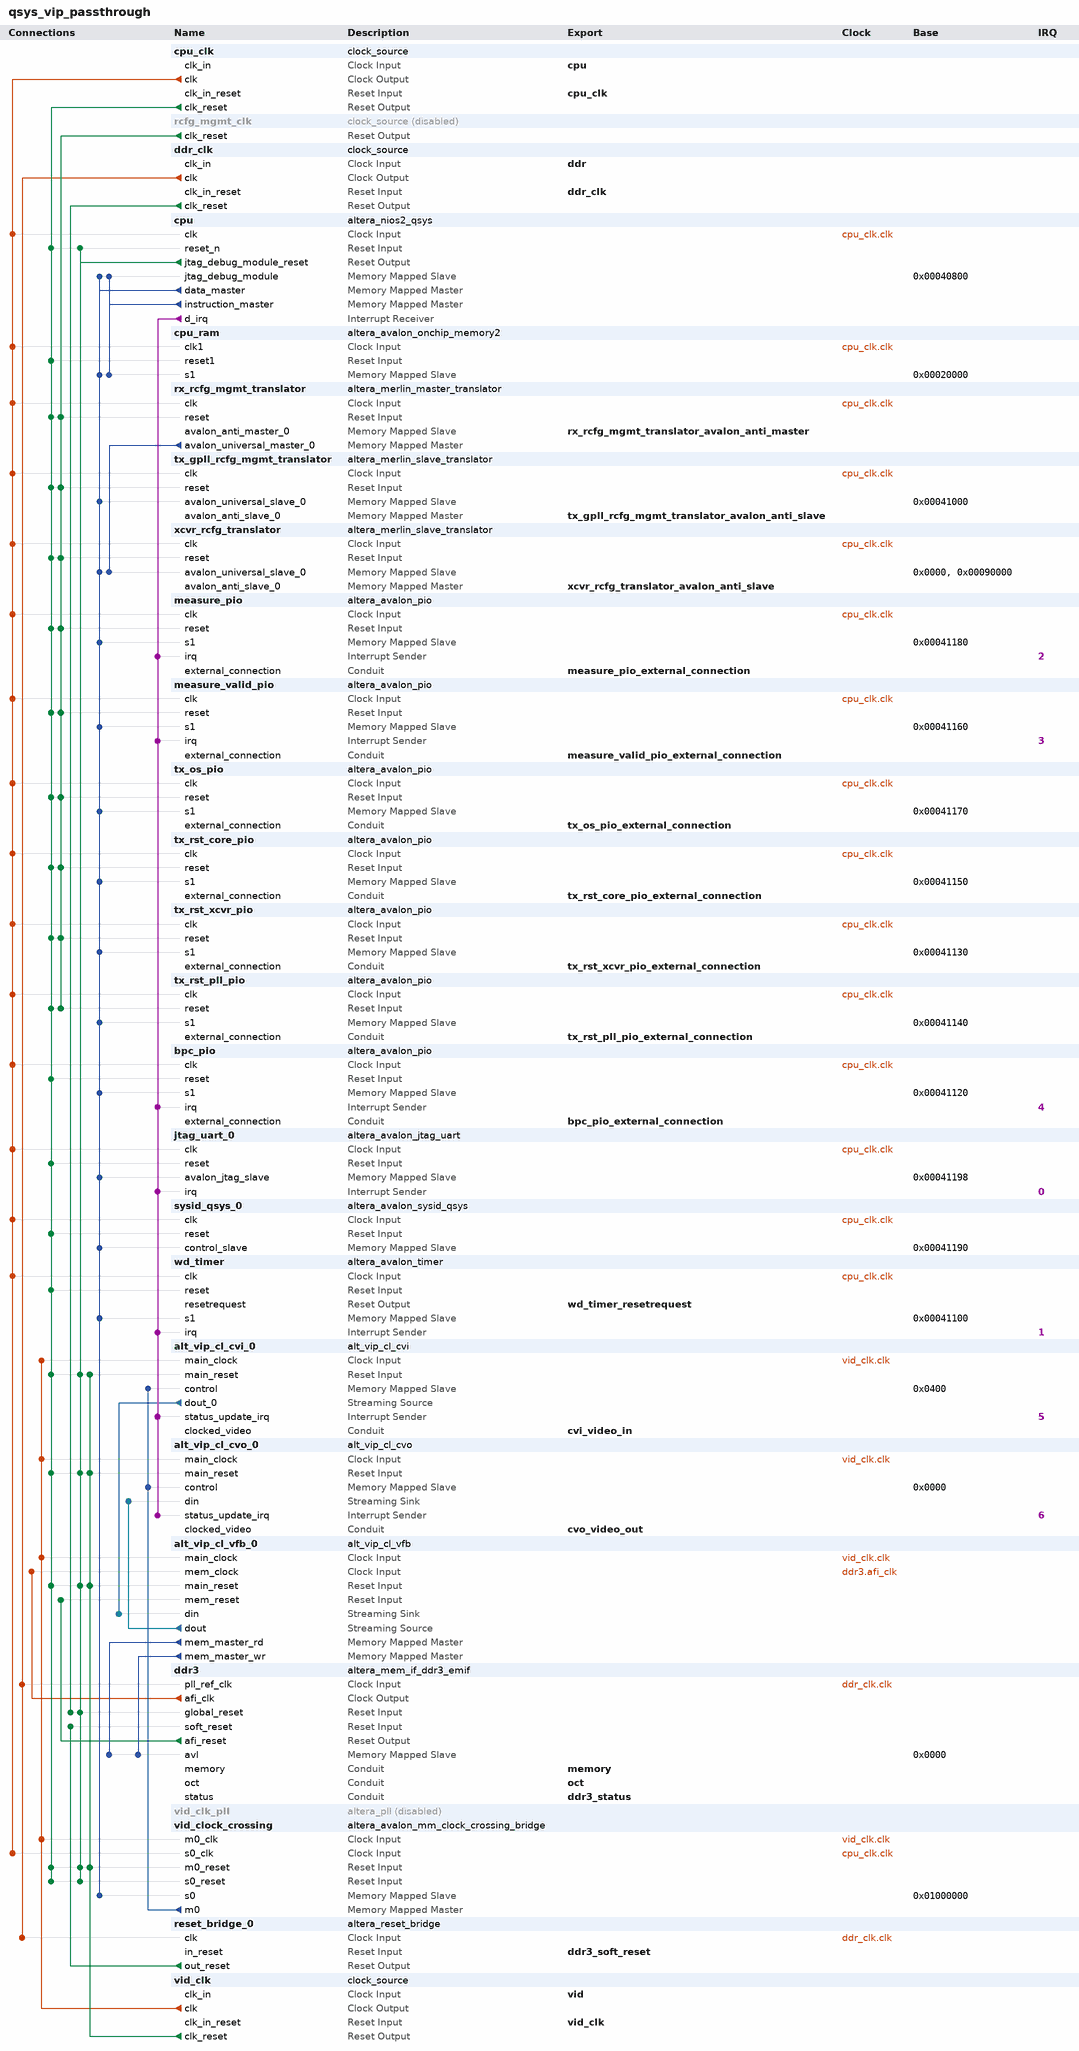
[diagram p0: system contents]
# Platform Designer (Qsys) system qsys_vip_passthrough, Arria V 5AGXFB3H4F35C4
# Parameters at their usual value, and those the tool derives, are not listed.
package require -exact qsys 17.0
create_system qsys_vip_passthrough
set_project_property DEVICE_FAMILY {Arria V}
set_project_property DEVICE 5AGXFB3H4F35C4

add_instance cpu_clk clock_source 17.0
set_instance_parameter_value cpu_clk clockFrequency 75000000

add_instance rcfg_mgmt_clk clock_source 17.0
set_instance_property rcfg_mgmt_clk ENABLED false
set_instance_parameter_value rcfg_mgmt_clk clockFrequency 75000000

add_instance ddr_clk clock_source 17.0
set_instance_parameter_value ddr_clk clockFrequency 100000000

add_instance cpu altera_nios2_qsys 17.0
set_instance_parameter_value cpu breakSlave cpu.jtag_debug_module
set_instance_parameter_value cpu exceptionSlave cpu_ram.s1
set_instance_parameter_value cpu icache_size 4096
set_instance_parameter_value cpu impl Tiny
set_instance_parameter_value cpu mmu_TLBMissExcSlave None
set_instance_parameter_value cpu muldiv_multiplierType DSPBlock
set_instance_parameter_value cpu resetSlave cpu_ram.s1
set_instance_parameter_value cpu resetrequest_enabled true

add_instance cpu_ram altera_avalon_onchip_memory2 17.0
set_instance_parameter_value cpu_ram dataWidth 32
set_instance_parameter_value cpu_ram dualPort false
set_instance_parameter_value cpu_ram initMemContent true
set_instance_parameter_value cpu_ram initializationFileName onchip_mem.hex
set_instance_parameter_value cpu_ram memorySize 80000

add_instance rx_rcfg_mgmt_translator altera_merlin_master_translator 17.0
set_instance_parameter_value rx_rcfg_mgmt_translator AV_ADDRESSGROUP 0
set_instance_parameter_value rx_rcfg_mgmt_translator AV_ADDRESS_SYMBOLS 1
set_instance_parameter_value rx_rcfg_mgmt_translator AV_ADDRESS_W 9
set_instance_parameter_value rx_rcfg_mgmt_translator AV_ALWAYSBURSTMAXBURST 0
set_instance_parameter_value rx_rcfg_mgmt_translator AV_BITS_PER_SYMBOL 8
set_instance_parameter_value rx_rcfg_mgmt_translator AV_BURSTBOUNDARIES 0
set_instance_parameter_value rx_rcfg_mgmt_translator AV_BURSTCOUNT_SYMBOLS 0
set_instance_parameter_value rx_rcfg_mgmt_translator AV_BURSTCOUNT_W 1
set_instance_parameter_value rx_rcfg_mgmt_translator AV_BYTEENABLE_W 4
set_instance_parameter_value rx_rcfg_mgmt_translator AV_CONSTANT_BURST_BEHAVIOR 0
set_instance_parameter_value rx_rcfg_mgmt_translator AV_DATA_HOLD 0
set_instance_parameter_value rx_rcfg_mgmt_translator AV_DATA_W 32
set_instance_parameter_value rx_rcfg_mgmt_translator AV_INTERLEAVEBURSTS 0
set_instance_parameter_value rx_rcfg_mgmt_translator AV_ISBIGENDIAN 0
set_instance_parameter_value rx_rcfg_mgmt_translator AV_LINEWRAPBURSTS 0
set_instance_parameter_value rx_rcfg_mgmt_translator AV_MAX_PENDING_READ_TRANSACTIONS 64
set_instance_parameter_value rx_rcfg_mgmt_translator AV_READLATENCY 0
set_instance_parameter_value rx_rcfg_mgmt_translator AV_READ_WAIT 0
set_instance_parameter_value rx_rcfg_mgmt_translator AV_REGISTERINCOMINGSIGNALS 0
set_instance_parameter_value rx_rcfg_mgmt_translator AV_REGISTEROUTGOINGSIGNALS 0
set_instance_parameter_value rx_rcfg_mgmt_translator AV_SETUP_WAIT 0
set_instance_parameter_value rx_rcfg_mgmt_translator AV_SYMBOLS_PER_WORD 4
set_instance_parameter_value rx_rcfg_mgmt_translator AV_WRITE_WAIT 0
set_instance_parameter_value rx_rcfg_mgmt_translator SYNC_RESET 0
set_instance_parameter_value rx_rcfg_mgmt_translator UAV_ADDRESSGROUP 0
set_instance_parameter_value rx_rcfg_mgmt_translator UAV_ADDRESS_W 9
set_instance_parameter_value rx_rcfg_mgmt_translator UAV_BURSTCOUNT_W 3
set_instance_parameter_value rx_rcfg_mgmt_translator UAV_CONSTANT_BURST_BEHAVIOR 0
set_instance_parameter_value rx_rcfg_mgmt_translator USE_ADDRESS 1
set_instance_parameter_value rx_rcfg_mgmt_translator USE_BEGINBURSTTRANSFER 0
set_instance_parameter_value rx_rcfg_mgmt_translator USE_BEGINTRANSFER 0
set_instance_parameter_value rx_rcfg_mgmt_translator USE_BURSTCOUNT 0
set_instance_parameter_value rx_rcfg_mgmt_translator USE_BYTEENABLE 0
set_instance_parameter_value rx_rcfg_mgmt_translator USE_CHIPSELECT 0
set_instance_parameter_value rx_rcfg_mgmt_translator USE_CLKEN 0
set_instance_parameter_value rx_rcfg_mgmt_translator USE_DEBUGACCESS 0
set_instance_parameter_value rx_rcfg_mgmt_translator USE_LOCK 0
set_instance_parameter_value rx_rcfg_mgmt_translator USE_READ 1
set_instance_parameter_value rx_rcfg_mgmt_translator USE_READDATA 1
set_instance_parameter_value rx_rcfg_mgmt_translator USE_READDATAVALID 0
set_instance_parameter_value rx_rcfg_mgmt_translator USE_READRESPONSE 0
set_instance_parameter_value rx_rcfg_mgmt_translator USE_WAITREQUEST 1
set_instance_parameter_value rx_rcfg_mgmt_translator USE_WRITE 1
set_instance_parameter_value rx_rcfg_mgmt_translator USE_WRITEDATA 1
set_instance_parameter_value rx_rcfg_mgmt_translator USE_WRITERESPONSE 0

add_instance tx_gpll_rcfg_mgmt_translator altera_merlin_slave_translator 17.0
set_instance_parameter_value tx_gpll_rcfg_mgmt_translator AV_ADDRESSGROUP 0
set_instance_parameter_value tx_gpll_rcfg_mgmt_translator AV_ADDRESS_SYMBOLS 0
set_instance_parameter_value tx_gpll_rcfg_mgmt_translator AV_ADDRESS_W 6
set_instance_parameter_value tx_gpll_rcfg_mgmt_translator AV_ALWAYSBURSTMAXBURST 0
set_instance_parameter_value tx_gpll_rcfg_mgmt_translator AV_BITS_PER_SYMBOL 8
set_instance_parameter_value tx_gpll_rcfg_mgmt_translator AV_BURSTBOUNDARIES 0
set_instance_parameter_value tx_gpll_rcfg_mgmt_translator AV_BURSTCOUNT_SYMBOLS 0
set_instance_parameter_value tx_gpll_rcfg_mgmt_translator AV_BURSTCOUNT_W 1
set_instance_parameter_value tx_gpll_rcfg_mgmt_translator AV_BYTEENABLE_W 4
set_instance_parameter_value tx_gpll_rcfg_mgmt_translator AV_CONSTANT_BURST_BEHAVIOR 0
set_instance_parameter_value tx_gpll_rcfg_mgmt_translator AV_DATA_HOLD 0
set_instance_parameter_value tx_gpll_rcfg_mgmt_translator AV_DATA_W 32
set_instance_parameter_value tx_gpll_rcfg_mgmt_translator AV_INTERLEAVEBURSTS 0
set_instance_parameter_value tx_gpll_rcfg_mgmt_translator AV_ISBIGENDIAN 0
set_instance_parameter_value tx_gpll_rcfg_mgmt_translator AV_LINEWRAPBURSTS 0
set_instance_parameter_value tx_gpll_rcfg_mgmt_translator AV_MAX_PENDING_READ_TRANSACTIONS 64
set_instance_parameter_value tx_gpll_rcfg_mgmt_translator AV_MAX_PENDING_WRITE_TRANSACTIONS 0
set_instance_parameter_value tx_gpll_rcfg_mgmt_translator AV_READLATENCY 0
set_instance_parameter_value tx_gpll_rcfg_mgmt_translator AV_READ_WAIT 1
set_instance_parameter_value tx_gpll_rcfg_mgmt_translator AV_REGISTERINCOMINGSIGNALS 0
set_instance_parameter_value tx_gpll_rcfg_mgmt_translator AV_REGISTEROUTGOINGSIGNALS 0
set_instance_parameter_value tx_gpll_rcfg_mgmt_translator AV_REQUIRE_UNALIGNED_ADDRESSES 0
set_instance_parameter_value tx_gpll_rcfg_mgmt_translator AV_SETUP_WAIT 0
set_instance_parameter_value tx_gpll_rcfg_mgmt_translator AV_SYMBOLS_PER_WORD 4
set_instance_parameter_value tx_gpll_rcfg_mgmt_translator AV_TIMING_UNITS 1
set_instance_parameter_value tx_gpll_rcfg_mgmt_translator AV_WRITE_WAIT 0
set_instance_parameter_value tx_gpll_rcfg_mgmt_translator CHIPSELECT_THROUGH_READLATENCY 0
set_instance_parameter_value tx_gpll_rcfg_mgmt_translator CLOCK_RATE 75000000
set_instance_parameter_value tx_gpll_rcfg_mgmt_translator UAV_ADDRESSGROUP 0
set_instance_parameter_value tx_gpll_rcfg_mgmt_translator UAV_ADDRESS_W 9
set_instance_parameter_value tx_gpll_rcfg_mgmt_translator UAV_BURSTCOUNT_W 3
set_instance_parameter_value tx_gpll_rcfg_mgmt_translator UAV_BYTEENABLE_W 4
set_instance_parameter_value tx_gpll_rcfg_mgmt_translator UAV_CONSTANT_BURST_BEHAVIOR 0
set_instance_parameter_value tx_gpll_rcfg_mgmt_translator UAV_DATA_W 32
set_instance_parameter_value tx_gpll_rcfg_mgmt_translator USE_ADDRESS 1
set_instance_parameter_value tx_gpll_rcfg_mgmt_translator USE_AV_CLKEN 0
set_instance_parameter_value tx_gpll_rcfg_mgmt_translator USE_BEGINBURSTTRANSFER 0
set_instance_parameter_value tx_gpll_rcfg_mgmt_translator USE_BEGINTRANSFER 0
set_instance_parameter_value tx_gpll_rcfg_mgmt_translator USE_BURSTCOUNT 0
set_instance_parameter_value tx_gpll_rcfg_mgmt_translator USE_BYTEENABLE 0
set_instance_parameter_value tx_gpll_rcfg_mgmt_translator USE_CHIPSELECT 0
set_instance_parameter_value tx_gpll_rcfg_mgmt_translator USE_DEBUGACCESS 0
set_instance_parameter_value tx_gpll_rcfg_mgmt_translator USE_LOCK 0
set_instance_parameter_value tx_gpll_rcfg_mgmt_translator USE_OUTPUTENABLE 0
set_instance_parameter_value tx_gpll_rcfg_mgmt_translator USE_READ 1
set_instance_parameter_value tx_gpll_rcfg_mgmt_translator USE_READDATA 1
set_instance_parameter_value tx_gpll_rcfg_mgmt_translator USE_READDATAVALID 0
set_instance_parameter_value tx_gpll_rcfg_mgmt_translator USE_READRESPONSE 0
set_instance_parameter_value tx_gpll_rcfg_mgmt_translator USE_UAV_CLKEN 0
set_instance_parameter_value tx_gpll_rcfg_mgmt_translator USE_WAITREQUEST 1
set_instance_parameter_value tx_gpll_rcfg_mgmt_translator USE_WRITE 1
set_instance_parameter_value tx_gpll_rcfg_mgmt_translator USE_WRITEBYTEENABLE 0
set_instance_parameter_value tx_gpll_rcfg_mgmt_translator USE_WRITEDATA 1
set_instance_parameter_value tx_gpll_rcfg_mgmt_translator USE_WRITERESPONSE 0

add_instance xcvr_rcfg_translator altera_merlin_slave_translator 17.0
set_instance_parameter_value xcvr_rcfg_translator AV_ADDRESSGROUP 0
set_instance_parameter_value xcvr_rcfg_translator AV_ADDRESS_SYMBOLS 0
set_instance_parameter_value xcvr_rcfg_translator AV_ADDRESS_W 7
set_instance_parameter_value xcvr_rcfg_translator AV_ALWAYSBURSTMAXBURST 0
set_instance_parameter_value xcvr_rcfg_translator AV_BITS_PER_SYMBOL 8
set_instance_parameter_value xcvr_rcfg_translator AV_BURSTBOUNDARIES 0
set_instance_parameter_value xcvr_rcfg_translator AV_BURSTCOUNT_SYMBOLS 0
set_instance_parameter_value xcvr_rcfg_translator AV_BURSTCOUNT_W 1
set_instance_parameter_value xcvr_rcfg_translator AV_BYTEENABLE_W 4
set_instance_parameter_value xcvr_rcfg_translator AV_CONSTANT_BURST_BEHAVIOR 0
set_instance_parameter_value xcvr_rcfg_translator AV_DATA_HOLD 0
set_instance_parameter_value xcvr_rcfg_translator AV_DATA_W 32
set_instance_parameter_value xcvr_rcfg_translator AV_INTERLEAVEBURSTS 0
set_instance_parameter_value xcvr_rcfg_translator AV_ISBIGENDIAN 0
set_instance_parameter_value xcvr_rcfg_translator AV_LINEWRAPBURSTS 0
set_instance_parameter_value xcvr_rcfg_translator AV_MAX_PENDING_READ_TRANSACTIONS 64
set_instance_parameter_value xcvr_rcfg_translator AV_MAX_PENDING_WRITE_TRANSACTIONS 0
set_instance_parameter_value xcvr_rcfg_translator AV_READLATENCY 0
set_instance_parameter_value xcvr_rcfg_translator AV_READ_WAIT 1
set_instance_parameter_value xcvr_rcfg_translator AV_REGISTERINCOMINGSIGNALS 0
set_instance_parameter_value xcvr_rcfg_translator AV_REGISTEROUTGOINGSIGNALS 0
set_instance_parameter_value xcvr_rcfg_translator AV_REQUIRE_UNALIGNED_ADDRESSES 0
set_instance_parameter_value xcvr_rcfg_translator AV_SETUP_WAIT 0
set_instance_parameter_value xcvr_rcfg_translator AV_SYMBOLS_PER_WORD 4
set_instance_parameter_value xcvr_rcfg_translator AV_TIMING_UNITS 1
set_instance_parameter_value xcvr_rcfg_translator AV_WRITE_WAIT 0
set_instance_parameter_value xcvr_rcfg_translator CHIPSELECT_THROUGH_READLATENCY 0
set_instance_parameter_value xcvr_rcfg_translator CLOCK_RATE 75000000
set_instance_parameter_value xcvr_rcfg_translator UAV_ADDRESSGROUP 0
set_instance_parameter_value xcvr_rcfg_translator UAV_ADDRESS_W 9
set_instance_parameter_value xcvr_rcfg_translator UAV_BURSTCOUNT_W 3
set_instance_parameter_value xcvr_rcfg_translator UAV_BYTEENABLE_W 4
set_instance_parameter_value xcvr_rcfg_translator UAV_CONSTANT_BURST_BEHAVIOR 0
set_instance_parameter_value xcvr_rcfg_translator UAV_DATA_W 32
set_instance_parameter_value xcvr_rcfg_translator USE_ADDRESS 1
set_instance_parameter_value xcvr_rcfg_translator USE_AV_CLKEN 0
set_instance_parameter_value xcvr_rcfg_translator USE_BEGINBURSTTRANSFER 0
set_instance_parameter_value xcvr_rcfg_translator USE_BEGINTRANSFER 0
set_instance_parameter_value xcvr_rcfg_translator USE_BURSTCOUNT 0
set_instance_parameter_value xcvr_rcfg_translator USE_BYTEENABLE 0
set_instance_parameter_value xcvr_rcfg_translator USE_CHIPSELECT 0
set_instance_parameter_value xcvr_rcfg_translator USE_DEBUGACCESS 0
set_instance_parameter_value xcvr_rcfg_translator USE_LOCK 0
set_instance_parameter_value xcvr_rcfg_translator USE_OUTPUTENABLE 0
set_instance_parameter_value xcvr_rcfg_translator USE_READ 1
set_instance_parameter_value xcvr_rcfg_translator USE_READDATA 1
set_instance_parameter_value xcvr_rcfg_translator USE_READDATAVALID 0
set_instance_parameter_value xcvr_rcfg_translator USE_READRESPONSE 0
set_instance_parameter_value xcvr_rcfg_translator USE_UAV_CLKEN 0
set_instance_parameter_value xcvr_rcfg_translator USE_WAITREQUEST 1
set_instance_parameter_value xcvr_rcfg_translator USE_WRITE 1
set_instance_parameter_value xcvr_rcfg_translator USE_WRITEBYTEENABLE 0
set_instance_parameter_value xcvr_rcfg_translator USE_WRITEDATA 1
set_instance_parameter_value xcvr_rcfg_translator USE_WRITERESPONSE 0

add_instance measure_pio altera_avalon_pio 17.0
set_instance_parameter_value measure_pio bitClearingEdgeCapReg true
set_instance_parameter_value measure_pio captureEdge true
set_instance_parameter_value measure_pio direction Input
set_instance_parameter_value measure_pio edgeType ANY
set_instance_parameter_value measure_pio generateIRQ true
set_instance_parameter_value measure_pio irqType EDGE
set_instance_parameter_value measure_pio simDoTestBenchWiring true
set_instance_parameter_value measure_pio width 24

add_instance measure_valid_pio altera_avalon_pio 17.0
set_instance_parameter_value measure_valid_pio bitClearingEdgeCapReg true
set_instance_parameter_value measure_valid_pio captureEdge true
set_instance_parameter_value measure_valid_pio direction Input
set_instance_parameter_value measure_valid_pio edgeType ANY
set_instance_parameter_value measure_valid_pio generateIRQ true
set_instance_parameter_value measure_valid_pio irqType EDGE
set_instance_parameter_value measure_valid_pio simDoTestBenchWiring true
set_instance_parameter_value measure_valid_pio width 1

add_instance tx_os_pio altera_avalon_pio 17.0
set_instance_parameter_value tx_os_pio direction Output
set_instance_parameter_value tx_os_pio width 1

add_instance tx_rst_core_pio altera_avalon_pio 17.0
set_instance_parameter_value tx_rst_core_pio direction Output
set_instance_parameter_value tx_rst_core_pio width 1

add_instance tx_rst_xcvr_pio altera_avalon_pio 17.0
set_instance_parameter_value tx_rst_xcvr_pio direction Output
set_instance_parameter_value tx_rst_xcvr_pio width 1

add_instance tx_rst_pll_pio altera_avalon_pio 17.0
set_instance_parameter_value tx_rst_pll_pio direction Output
set_instance_parameter_value tx_rst_pll_pio width 1

add_instance bpc_pio altera_avalon_pio 17.0
set_instance_parameter_value bpc_pio bitClearingEdgeCapReg true
set_instance_parameter_value bpc_pio captureEdge true
set_instance_parameter_value bpc_pio direction Input
set_instance_parameter_value bpc_pio edgeType ANY
set_instance_parameter_value bpc_pio generateIRQ true
set_instance_parameter_value bpc_pio irqType EDGE
set_instance_parameter_value bpc_pio width 2

add_instance jtag_uart_0 altera_avalon_jtag_uart 17.0
set_instance_parameter_value jtag_uart_0 readBufferDepth 1024
set_instance_parameter_value jtag_uart_0 readIRQThreshold 1
set_instance_parameter_value jtag_uart_0 simInteractiveOptions NO_INTERACTIVE_WINDOWS
set_instance_parameter_value jtag_uart_0 writeBufferDepth 1024
set_instance_parameter_value jtag_uart_0 writeIRQThreshold 1

add_instance sysid_qsys_0 altera_avalon_sysid_qsys 17.0
set_instance_parameter_value sysid_qsys_0 id 0

add_instance wd_timer altera_avalon_timer 17.0
set_instance_parameter_value wd_timer alwaysRun true
set_instance_parameter_value wd_timer fixedPeriod true
set_instance_parameter_value wd_timer period 600
set_instance_parameter_value wd_timer periodUnits MSEC
set_instance_parameter_value wd_timer resetOutput true
set_instance_parameter_value wd_timer snapshot false

add_instance alt_vip_cl_cvi_0 alt_vip_cl_cvi 17.0
set_instance_parameter_value alt_vip_cl_cvi_0 ACCEPT_COLOURS_IN_SEQ 0
set_instance_parameter_value alt_vip_cl_cvi_0 ANC_DEPTH 1
set_instance_parameter_value alt_vip_cl_cvi_0 BPS 8
set_instance_parameter_value alt_vip_cl_cvi_0 CLOCKS_ARE_SAME 0
set_instance_parameter_value alt_vip_cl_cvi_0 COLOUR_PLANES_ARE_IN_PARALLEL 1
set_instance_parameter_value alt_vip_cl_cvi_0 EXTRACT_TOTAL_RESOLUTION 1
set_instance_parameter_value alt_vip_cl_cvi_0 FIFO_DEPTH 4096
set_instance_parameter_value alt_vip_cl_cvi_0 GENERATE_ANC 0
set_instance_parameter_value alt_vip_cl_cvi_0 GENERATE_VID_F 0
set_instance_parameter_value alt_vip_cl_cvi_0 H_ACTIVE_PIXELS_F0 1920
set_instance_parameter_value alt_vip_cl_cvi_0 INTERLACED 0
set_instance_parameter_value alt_vip_cl_cvi_0 NO_OF_CHANNELS 1
set_instance_parameter_value alt_vip_cl_cvi_0 NUMBER_OF_COLOUR_PLANES 3
set_instance_parameter_value alt_vip_cl_cvi_0 PIXELS_IN_PARALLEL 2
set_instance_parameter_value alt_vip_cl_cvi_0 STD_WIDTH 1
set_instance_parameter_value alt_vip_cl_cvi_0 SYNC_TO 0
set_instance_parameter_value alt_vip_cl_cvi_0 USE_CONTROL 1
set_instance_parameter_value alt_vip_cl_cvi_0 USE_EMBEDDED_SYNCS 0
set_instance_parameter_value alt_vip_cl_cvi_0 USE_HDMI_DEPRICATION 0
set_instance_parameter_value alt_vip_cl_cvi_0 USE_STD 0
set_instance_parameter_value alt_vip_cl_cvi_0 V_ACTIVE_LINES_F0 1080
set_instance_parameter_value alt_vip_cl_cvi_0 V_ACTIVE_LINES_F1 480

add_instance alt_vip_cl_cvo_0 alt_vip_cl_cvo 17.0
set_instance_parameter_value alt_vip_cl_cvo_0 ACCEPT_COLOURS_IN_SEQ 0
set_instance_parameter_value alt_vip_cl_cvo_0 ANC_LINE 0
set_instance_parameter_value alt_vip_cl_cvo_0 AP_LINE 0
set_instance_parameter_value alt_vip_cl_cvo_0 BPS 8
set_instance_parameter_value alt_vip_cl_cvo_0 CLOCKS_ARE_SAME 0
set_instance_parameter_value alt_vip_cl_cvo_0 COLOUR_PLANES_ARE_IN_PARALLEL 1
set_instance_parameter_value alt_vip_cl_cvo_0 CONTEXT_WIDTH 8
set_instance_parameter_value alt_vip_cl_cvo_0 DST_WIDTH 8
set_instance_parameter_value alt_vip_cl_cvo_0 FIELD0_ANC_LINE 0
set_instance_parameter_value alt_vip_cl_cvo_0 FIELD0_V_BACK_PORCH 0
set_instance_parameter_value alt_vip_cl_cvo_0 FIELD0_V_BLANK 0
set_instance_parameter_value alt_vip_cl_cvo_0 FIELD0_V_FRONT_PORCH 0
set_instance_parameter_value alt_vip_cl_cvo_0 FIELD0_V_RISING_EDGE 0
set_instance_parameter_value alt_vip_cl_cvo_0 FIELD0_V_SYNC_LENGTH 0
set_instance_parameter_value alt_vip_cl_cvo_0 FIFO_DEPTH 4096
set_instance_parameter_value alt_vip_cl_cvo_0 F_FALLING_EDGE 0
set_instance_parameter_value alt_vip_cl_cvo_0 F_RISING_EDGE 0
set_instance_parameter_value alt_vip_cl_cvo_0 GENERATE_SYNC 0
set_instance_parameter_value alt_vip_cl_cvo_0 H_ACTIVE_PIXELS 3840
set_instance_parameter_value alt_vip_cl_cvo_0 H_BACK_PORCH 148
set_instance_parameter_value alt_vip_cl_cvo_0 H_BLANK 560
set_instance_parameter_value alt_vip_cl_cvo_0 H_FRONT_PORCH 40
set_instance_parameter_value alt_vip_cl_cvo_0 H_SYNC_LENGTH 120
set_instance_parameter_value alt_vip_cl_cvo_0 INTERLACED 0
set_instance_parameter_value alt_vip_cl_cvo_0 NO_OF_CHANNELS 1
set_instance_parameter_value alt_vip_cl_cvo_0 NO_OF_MODES 4
set_instance_parameter_value alt_vip_cl_cvo_0 NUMBER_OF_COLOUR_PLANES 3
set_instance_parameter_value alt_vip_cl_cvo_0 PIXELS_IN_PARALLEL 2
set_instance_parameter_value alt_vip_cl_cvo_0 SRC_WIDTH 8
set_instance_parameter_value alt_vip_cl_cvo_0 STD_WIDTH 1
set_instance_parameter_value alt_vip_cl_cvo_0 TASK_WIDTH 8
set_instance_parameter_value alt_vip_cl_cvo_0 THRESHOLD 3839
set_instance_parameter_value alt_vip_cl_cvo_0 USE_CONTROL 1
set_instance_parameter_value alt_vip_cl_cvo_0 USE_EMBEDDED_SYNCS 0
set_instance_parameter_value alt_vip_cl_cvo_0 V_ACTIVE_LINES 2160
set_instance_parameter_value alt_vip_cl_cvo_0 V_BACK_PORCH 36
set_instance_parameter_value alt_vip_cl_cvo_0 V_BLANK 90
set_instance_parameter_value alt_vip_cl_cvo_0 V_FRONT_PORCH 0
set_instance_parameter_value alt_vip_cl_cvo_0 V_SYNC_LENGTH 0

add_instance alt_vip_cl_vfb_0 alt_vip_cl_vfb 17.0
set_instance_parameter_value alt_vip_cl_vfb_0 CLOCKS_ARE_SEPARATE 1
set_instance_parameter_value alt_vip_cl_vfb_0 CORRECT_INVALID_FIELDS 0
set_instance_parameter_value alt_vip_cl_vfb_0 DROP_FRAMES 1
set_instance_parameter_value alt_vip_cl_vfb_0 FAMILY {Arria V}
set_instance_parameter_value alt_vip_cl_vfb_0 IS_FRAME_READER 0
set_instance_parameter_value alt_vip_cl_vfb_0 MAX_HEIGHT 2160
set_instance_parameter_value alt_vip_cl_vfb_0 MAX_WIDTH 3840
set_instance_parameter_value alt_vip_cl_vfb_0 MEM_BASE_ADDR 268435456
set_instance_parameter_value alt_vip_cl_vfb_0 MEM_PORT_WIDTH 256
set_instance_parameter_value alt_vip_cl_vfb_0 PIXELS_IN_PARALLEL 2
set_instance_parameter_value alt_vip_cl_vfb_0 READER_RUNTIME_CONTROL 0
set_instance_parameter_value alt_vip_cl_vfb_0 READ_FIFO_DEPTH 64
set_instance_parameter_value alt_vip_cl_vfb_0 USER_PACKETS_MAX_STORAGE 0
set_instance_parameter_value alt_vip_cl_vfb_0 WRITE_BURST_TARGET 32
set_instance_parameter_value alt_vip_cl_vfb_0 WRITE_FIFO_DEPTH 64

add_instance ddr3 altera_mem_if_ddr3_emif 17.0
set_instance_parameter_value ddr3 AVL_MAX_SIZE 64
set_instance_parameter_value ddr3 CALIBRATION_MODE Skip
set_instance_parameter_value ddr3 CPORT_TYPE_PORT Bidirectional,Bidirectional,Bidirectional,Bidirectional,Bidirectional,Bidirectional
set_instance_parameter_value ddr3 EXPORT_AFI_HALF_CLK false
set_instance_parameter_value ddr3 HARD_EMIF false
set_instance_parameter_value ddr3 MEM_BANKADDR_WIDTH 3
set_instance_parameter_value ddr3 MEM_CLK_FREQ 400.0
set_instance_parameter_value ddr3 MEM_CLK_FREQ_MAX 666.667
set_instance_parameter_value ddr3 MEM_COL_ADDR_WIDTH 10
set_instance_parameter_value ddr3 MEM_DQ_WIDTH 32
set_instance_parameter_value ddr3 MEM_DRV_STR RZQ/6
set_instance_parameter_value ddr3 MEM_FORMAT DISCRETE
set_instance_parameter_value ddr3 MEM_ROW_ADDR_WIDTH 13
set_instance_parameter_value ddr3 MEM_TCL 7
set_instance_parameter_value ddr3 MEM_TFAW_NS 45.0
set_instance_parameter_value ddr3 MEM_TRAS_NS 36.0
set_instance_parameter_value ddr3 MEM_TRCD_NS 13.5
set_instance_parameter_value ddr3 MEM_TRFC_NS 110.0
set_instance_parameter_value ddr3 MEM_TRP_NS 13.5
set_instance_parameter_value ddr3 MEM_TRRD_NS 7.5
set_instance_parameter_value ddr3 MEM_TRTP_NS 7.5
set_instance_parameter_value ddr3 MEM_TWTR 5
set_instance_parameter_value ddr3 MEM_VENDOR Micron
set_instance_parameter_value ddr3 MEM_WTCL 6
set_instance_parameter_value ddr3 PLL_LOCATION Top_Bottom
set_instance_parameter_value ddr3 POWER_OF_TWO_BUS false
set_instance_parameter_value ddr3 PRIORITY_PORT 1,1,1,1,1,1
set_instance_parameter_value ddr3 RATE Quarter
set_instance_parameter_value ddr3 REF_CLK_FREQ 100.0
set_instance_parameter_value ddr3 SPEED_GRADE 4
set_instance_parameter_value ddr3 TIMING_BOARD_AC_SKEW 0.0039
set_instance_parameter_value ddr3 TIMING_BOARD_AC_TO_CK_SKEW -0.001
set_instance_parameter_value ddr3 TIMING_BOARD_DERATE_METHOD SLEW_RATE
set_instance_parameter_value ddr3 TIMING_BOARD_DQ_TO_DQS_SKEW -0.004
set_instance_parameter_value ddr3 TIMING_BOARD_MAX_CK_DELAY 0.42
set_instance_parameter_value ddr3 TIMING_BOARD_MAX_DQS_DELAY 0.437
set_instance_parameter_value ddr3 TIMING_BOARD_SKEW_BETWEEN_DQS 0.029
set_instance_parameter_value ddr3 TIMING_BOARD_SKEW_CKDQS_DIMM_MAX 0.012
set_instance_parameter_value ddr3 TIMING_BOARD_SKEW_CKDQS_DIMM_MIN -0.0039
set_instance_parameter_value ddr3 TIMING_BOARD_SKEW_WITHIN_DQS 0.011
set_instance_parameter_value ddr3 TIMING_TDH 65
set_instance_parameter_value ddr3 TIMING_TDQSCK 255
set_instance_parameter_value ddr3 TIMING_TDQSQ 125
set_instance_parameter_value ddr3 TIMING_TDQSS 0.25
set_instance_parameter_value ddr3 TIMING_TDS 30
set_instance_parameter_value ddr3 TIMING_TDSH 0.2
set_instance_parameter_value ddr3 TIMING_TDSS 0.2
set_instance_parameter_value ddr3 TIMING_TIH 140
set_instance_parameter_value ddr3 TIMING_TIS 190
set_instance_parameter_value ddr3 TIMING_TQSH 0.4
set_instance_parameter_value ddr3 USER_DEBUG_LEVEL 1

add_instance vid_clk_pll altera_pll 17.0
set_instance_property vid_clk_pll ENABLED false
set_instance_parameter_value vid_clk_pll gui_device_speed_grade 2
set_instance_parameter_value vid_clk_pll gui_number_of_clocks 1
set_instance_parameter_value vid_clk_pll gui_operation_mode direct
set_instance_parameter_value vid_clk_pll gui_output_clock_frequency0 150.0
set_instance_parameter_value vid_clk_pll gui_pll_mode {Integer-N PLL}
set_instance_parameter_value vid_clk_pll gui_reference_clock_frequency 100.0
set_instance_parameter_value vid_clk_pll gui_use_locked false

add_instance vid_clock_crossing altera_avalon_mm_clock_crossing_bridge 17.0
set_instance_parameter_value vid_clock_crossing ADDRESS_WIDTH 15
set_instance_parameter_value vid_clock_crossing COMMAND_FIFO_DEPTH 4
set_instance_parameter_value vid_clock_crossing DATA_WIDTH 32
set_instance_parameter_value vid_clock_crossing MASTER_SYNC_DEPTH 2
set_instance_parameter_value vid_clock_crossing MAX_BURST_SIZE 1
set_instance_parameter_value vid_clock_crossing RESPONSE_FIFO_DEPTH 4
set_instance_parameter_value vid_clock_crossing SLAVE_SYNC_DEPTH 2
set_instance_parameter_value vid_clock_crossing USE_AUTO_ADDRESS_WIDTH 0

add_instance reset_bridge_0 altera_reset_bridge 17.0
set_instance_parameter_value reset_bridge_0 ACTIVE_LOW_RESET 1
set_instance_parameter_value reset_bridge_0 SYNCHRONOUS_EDGES deassert

add_instance vid_clk clock_source 17.0
set_instance_parameter_value vid_clk clockFrequency 75000000

# connections
add_connection cpu_clk.clk bpc_pio.clk clock
add_connection cpu_clk.clk cpu.clk clock
add_connection cpu_clk.clk cpu_ram.clk1 clock
add_connection cpu_clk.clk jtag_uart_0.clk clock
add_connection cpu_clk.clk measure_pio.clk clock
add_connection cpu_clk.clk measure_valid_pio.clk clock
add_connection cpu_clk.clk rx_rcfg_mgmt_translator.clk clock
add_connection cpu_clk.clk sysid_qsys_0.clk clock
add_connection cpu_clk.clk tx_gpll_rcfg_mgmt_translator.clk clock
add_connection cpu_clk.clk tx_os_pio.clk clock
add_connection cpu_clk.clk tx_rst_core_pio.clk clock
add_connection cpu_clk.clk tx_rst_pll_pio.clk clock
add_connection cpu_clk.clk tx_rst_xcvr_pio.clk clock
add_connection cpu_clk.clk vid_clock_crossing.s0_clk clock
add_connection cpu_clk.clk wd_timer.clk clock
add_connection cpu_clk.clk xcvr_rcfg_translator.clk clock
add_connection ddr3.afi_clk alt_vip_cl_vfb_0.mem_clock clock
add_connection ddr_clk.clk ddr3.pll_ref_clk clock
add_connection ddr_clk.clk reset_bridge_0.clk clock
add_connection vid_clk.clk alt_vip_cl_cvi_0.main_clock clock
add_connection vid_clk.clk alt_vip_cl_cvo_0.main_clock clock
add_connection vid_clk.clk alt_vip_cl_vfb_0.main_clock clock
add_connection vid_clk.clk vid_clock_crossing.m0_clk clock
add_connection cpu.jtag_debug_module_reset alt_vip_cl_cvi_0.main_reset reset
add_connection cpu.jtag_debug_module_reset alt_vip_cl_cvo_0.main_reset reset
add_connection cpu.jtag_debug_module_reset alt_vip_cl_vfb_0.main_reset reset
add_connection cpu.jtag_debug_module_reset cpu.reset_n reset
add_connection cpu.jtag_debug_module_reset ddr3.global_reset reset
add_connection cpu.jtag_debug_module_reset vid_clock_crossing.m0_reset reset
add_connection cpu.jtag_debug_module_reset vid_clock_crossing.s0_reset reset
add_connection cpu_clk.clk_reset alt_vip_cl_cvi_0.main_reset reset
add_connection cpu_clk.clk_reset alt_vip_cl_cvo_0.main_reset reset
add_connection cpu_clk.clk_reset alt_vip_cl_vfb_0.main_reset reset
add_connection cpu_clk.clk_reset bpc_pio.reset reset
add_connection cpu_clk.clk_reset cpu.reset_n reset
add_connection cpu_clk.clk_reset cpu_ram.reset1 reset
add_connection cpu_clk.clk_reset jtag_uart_0.reset reset
add_connection cpu_clk.clk_reset measure_pio.reset reset
add_connection cpu_clk.clk_reset measure_valid_pio.reset reset
add_connection cpu_clk.clk_reset rx_rcfg_mgmt_translator.reset reset
add_connection cpu_clk.clk_reset sysid_qsys_0.reset reset
add_connection cpu_clk.clk_reset tx_gpll_rcfg_mgmt_translator.reset reset
add_connection cpu_clk.clk_reset tx_os_pio.reset reset
add_connection cpu_clk.clk_reset tx_rst_core_pio.reset reset
add_connection cpu_clk.clk_reset tx_rst_pll_pio.reset reset
add_connection cpu_clk.clk_reset tx_rst_xcvr_pio.reset reset
add_connection cpu_clk.clk_reset vid_clock_crossing.m0_reset reset
add_connection cpu_clk.clk_reset vid_clock_crossing.s0_reset reset
add_connection cpu_clk.clk_reset wd_timer.reset reset
add_connection cpu_clk.clk_reset xcvr_rcfg_translator.reset reset
add_connection ddr3.afi_reset alt_vip_cl_vfb_0.mem_reset reset
add_connection ddr_clk.clk_reset ddr3.global_reset reset
add_connection rcfg_mgmt_clk.clk_reset measure_pio.reset reset
add_connection rcfg_mgmt_clk.clk_reset measure_valid_pio.reset reset
add_connection rcfg_mgmt_clk.clk_reset rx_rcfg_mgmt_translator.reset reset
add_connection rcfg_mgmt_clk.clk_reset tx_gpll_rcfg_mgmt_translator.reset reset
add_connection rcfg_mgmt_clk.clk_reset tx_os_pio.reset reset
add_connection rcfg_mgmt_clk.clk_reset tx_rst_core_pio.reset reset
add_connection rcfg_mgmt_clk.clk_reset tx_rst_pll_pio.reset reset
add_connection rcfg_mgmt_clk.clk_reset tx_rst_xcvr_pio.reset reset
add_connection rcfg_mgmt_clk.clk_reset xcvr_rcfg_translator.reset reset
add_connection reset_bridge_0.out_reset ddr3.soft_reset reset
add_connection vid_clk.clk_reset alt_vip_cl_cvi_0.main_reset reset
add_connection vid_clk.clk_reset alt_vip_cl_cvo_0.main_reset reset
add_connection vid_clk.clk_reset alt_vip_cl_vfb_0.main_reset reset
add_connection vid_clk.clk_reset vid_clock_crossing.m0_reset reset
add_connection alt_vip_cl_vfb_0.mem_master_rd ddr3.avl avalon
set_connection_parameter_value alt_vip_cl_vfb_0.mem_master_rd/ddr3.avl baseAddress 0x0000
add_connection alt_vip_cl_vfb_0.mem_master_wr ddr3.avl avalon
set_connection_parameter_value alt_vip_cl_vfb_0.mem_master_wr/ddr3.avl baseAddress 0x0000
add_connection cpu.data_master bpc_pio.s1 avalon
set_connection_parameter_value cpu.data_master/bpc_pio.s1 baseAddress 0x00041120
add_connection cpu.data_master cpu.jtag_debug_module avalon
set_connection_parameter_value cpu.data_master/cpu.jtag_debug_module baseAddress 0x00040800
add_connection cpu.data_master cpu_ram.s1 avalon
set_connection_parameter_value cpu.data_master/cpu_ram.s1 baseAddress 0x00020000
add_connection cpu.data_master jtag_uart_0.avalon_jtag_slave avalon
set_connection_parameter_value cpu.data_master/jtag_uart_0.avalon_jtag_slave baseAddress 0x00041198
add_connection cpu.data_master measure_pio.s1 avalon
set_connection_parameter_value cpu.data_master/measure_pio.s1 baseAddress 0x00041180
add_connection cpu.data_master measure_valid_pio.s1 avalon
set_connection_parameter_value cpu.data_master/measure_valid_pio.s1 baseAddress 0x00041160
add_connection cpu.data_master sysid_qsys_0.control_slave avalon
set_connection_parameter_value cpu.data_master/sysid_qsys_0.control_slave baseAddress 0x00041190
add_connection cpu.data_master tx_gpll_rcfg_mgmt_translator.avalon_universal_slave_0 avalon
set_connection_parameter_value cpu.data_master/tx_gpll_rcfg_mgmt_translator.avalon_universal_slave_0 baseAddress 0x00041000
add_connection cpu.data_master tx_os_pio.s1 avalon
set_connection_parameter_value cpu.data_master/tx_os_pio.s1 baseAddress 0x00041170
add_connection cpu.data_master tx_rst_core_pio.s1 avalon
set_connection_parameter_value cpu.data_master/tx_rst_core_pio.s1 baseAddress 0x00041150
add_connection cpu.data_master tx_rst_pll_pio.s1 avalon
set_connection_parameter_value cpu.data_master/tx_rst_pll_pio.s1 baseAddress 0x00041140
add_connection cpu.data_master tx_rst_xcvr_pio.s1 avalon
set_connection_parameter_value cpu.data_master/tx_rst_xcvr_pio.s1 baseAddress 0x00041130
add_connection cpu.data_master vid_clock_crossing.s0 avalon
set_connection_parameter_value cpu.data_master/vid_clock_crossing.s0 baseAddress 0x01000000
add_connection cpu.data_master wd_timer.s1 avalon
set_connection_parameter_value cpu.data_master/wd_timer.s1 baseAddress 0x00041100
add_connection cpu.data_master xcvr_rcfg_translator.avalon_universal_slave_0 avalon
set_connection_parameter_value cpu.data_master/xcvr_rcfg_translator.avalon_universal_slave_0 baseAddress 0x00090000
add_connection cpu.instruction_master cpu.jtag_debug_module avalon
set_connection_parameter_value cpu.instruction_master/cpu.jtag_debug_module baseAddress 0x00040800
add_connection cpu.instruction_master cpu_ram.s1 avalon
set_connection_parameter_value cpu.instruction_master/cpu_ram.s1 baseAddress 0x00020000
add_connection rx_rcfg_mgmt_translator.avalon_universal_master_0 xcvr_rcfg_translator.avalon_universal_slave_0 avalon
set_connection_parameter_value rx_rcfg_mgmt_translator.avalon_universal_master_0/xcvr_rcfg_translator.avalon_universal_slave_0 baseAddress 0x0000
add_connection vid_clock_crossing.m0 alt_vip_cl_cvi_0.control avalon
set_connection_parameter_value vid_clock_crossing.m0/alt_vip_cl_cvi_0.control baseAddress 0x0400
add_connection vid_clock_crossing.m0 alt_vip_cl_cvo_0.control avalon
set_connection_parameter_value vid_clock_crossing.m0/alt_vip_cl_cvo_0.control baseAddress 0x0000
add_connection alt_vip_cl_cvi_0.dout_0 alt_vip_cl_vfb_0.din avalon_streaming
add_connection alt_vip_cl_vfb_0.dout alt_vip_cl_cvo_0.din avalon_streaming
add_connection cpu.d_irq alt_vip_cl_cvi_0.status_update_irq interrupt
set_connection_parameter_value cpu.d_irq/alt_vip_cl_cvi_0.status_update_irq irqNumber 5
add_connection cpu.d_irq alt_vip_cl_cvo_0.status_update_irq interrupt
set_connection_parameter_value cpu.d_irq/alt_vip_cl_cvo_0.status_update_irq irqNumber 6
add_connection cpu.d_irq bpc_pio.irq interrupt
set_connection_parameter_value cpu.d_irq/bpc_pio.irq irqNumber 4
add_connection cpu.d_irq jtag_uart_0.irq interrupt
set_connection_parameter_value cpu.d_irq/jtag_uart_0.irq irqNumber 0
add_connection cpu.d_irq measure_pio.irq interrupt
set_connection_parameter_value cpu.d_irq/measure_pio.irq irqNumber 2
add_connection cpu.d_irq measure_valid_pio.irq interrupt
set_connection_parameter_value cpu.d_irq/measure_valid_pio.irq irqNumber 3
add_connection cpu.d_irq wd_timer.irq interrupt
set_connection_parameter_value cpu.d_irq/wd_timer.irq irqNumber 1

# exported interfaces
add_interface bpc_pio_external_connection conduit end
set_interface_property bpc_pio_external_connection EXPORT_OF bpc_pio.external_connection
add_interface cpu clock sink
set_interface_property cpu EXPORT_OF cpu_clk.clk_in
add_interface cpu_clk reset sink
set_interface_property cpu_clk EXPORT_OF cpu_clk.clk_in_reset
add_interface cvi_video_in conduit end
set_interface_property cvi_video_in EXPORT_OF alt_vip_cl_cvi_0.clocked_video
add_interface cvo_video_out conduit end
set_interface_property cvo_video_out EXPORT_OF alt_vip_cl_cvo_0.clocked_video
add_interface ddr clock sink
set_interface_property ddr EXPORT_OF ddr_clk.clk_in
add_interface ddr3_soft_reset reset sink
set_interface_property ddr3_soft_reset EXPORT_OF reset_bridge_0.in_reset
add_interface ddr3_status conduit end
set_interface_property ddr3_status EXPORT_OF ddr3.status
add_interface ddr_clk reset sink
set_interface_property ddr_clk EXPORT_OF ddr_clk.clk_in_reset
add_interface measure_pio_external_connection conduit end
set_interface_property measure_pio_external_connection EXPORT_OF measure_pio.external_connection
add_interface measure_valid_pio_external_connection conduit end
set_interface_property measure_valid_pio_external_connection EXPORT_OF measure_valid_pio.external_connection
add_interface memory conduit end
set_interface_property memory EXPORT_OF ddr3.memory
add_interface oct conduit end
set_interface_property oct EXPORT_OF ddr3.oct
add_interface rx_rcfg_mgmt_translator_avalon_anti_master avalon slave
set_interface_property rx_rcfg_mgmt_translator_avalon_anti_master EXPORT_OF rx_rcfg_mgmt_translator.avalon_anti_master_0
add_interface tx_gpll_rcfg_mgmt_translator_avalon_anti_slave avalon master
set_interface_property tx_gpll_rcfg_mgmt_translator_avalon_anti_slave EXPORT_OF tx_gpll_rcfg_mgmt_translator.avalon_anti_slave_0
add_interface tx_os_pio_external_connection conduit end
set_interface_property tx_os_pio_external_connection EXPORT_OF tx_os_pio.external_connection
add_interface tx_rst_core_pio_external_connection conduit end
set_interface_property tx_rst_core_pio_external_connection EXPORT_OF tx_rst_core_pio.external_connection
add_interface tx_rst_pll_pio_external_connection conduit end
set_interface_property tx_rst_pll_pio_external_connection EXPORT_OF tx_rst_pll_pio.external_connection
add_interface tx_rst_xcvr_pio_external_connection conduit end
set_interface_property tx_rst_xcvr_pio_external_connection EXPORT_OF tx_rst_xcvr_pio.external_connection
add_interface vid clock sink
set_interface_property vid EXPORT_OF vid_clk.clk_in
add_interface vid_clk reset sink
set_interface_property vid_clk EXPORT_OF vid_clk.clk_in_reset
add_interface wd_timer_resetrequest reset source
set_interface_property wd_timer_resetrequest EXPORT_OF wd_timer.resetrequest
add_interface xcvr_rcfg_translator_avalon_anti_slave avalon master
set_interface_property xcvr_rcfg_translator_avalon_anti_slave EXPORT_OF xcvr_rcfg_translator.avalon_anti_slave_0

set_interconnect_requirement {$system} qsys_mm.clockCrossingAdapter AUTO
set_interconnect_requirement {$system} qsys_mm.insertDefaultSlave false
set_interconnect_requirement {$system} qsys_mm.maxAdditionalLatency 1

save_system qsys_vip_passthrough.qsys
